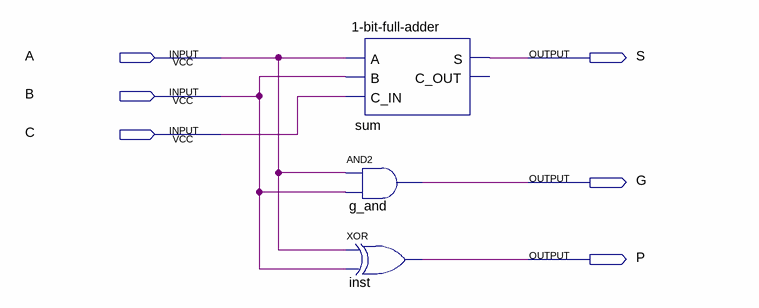
[diagram p0: schematic sheet]
// Quartus schematic 1-bit-carry-adder.bdf as structural Verilog: 3 symbols, 6 pins
module \1-bit-carry-adder  (
  input  A,
  input  B,
  input  C,
  output S,
  output G,
  output P
);

  \1-bit-full-adder  sum (.A(A), .B(B), .C_IN(C), .S(S));  // open: C_OUT
  and g_and (G, A, B);
  xor inst (P, A, B);
endmodule
